# Altium schematic sheet MCU1.SchDoc: MCU 1 - RP2350B
size 420 x 297 mm; SheetNumber: 3; SheetTotal: 8
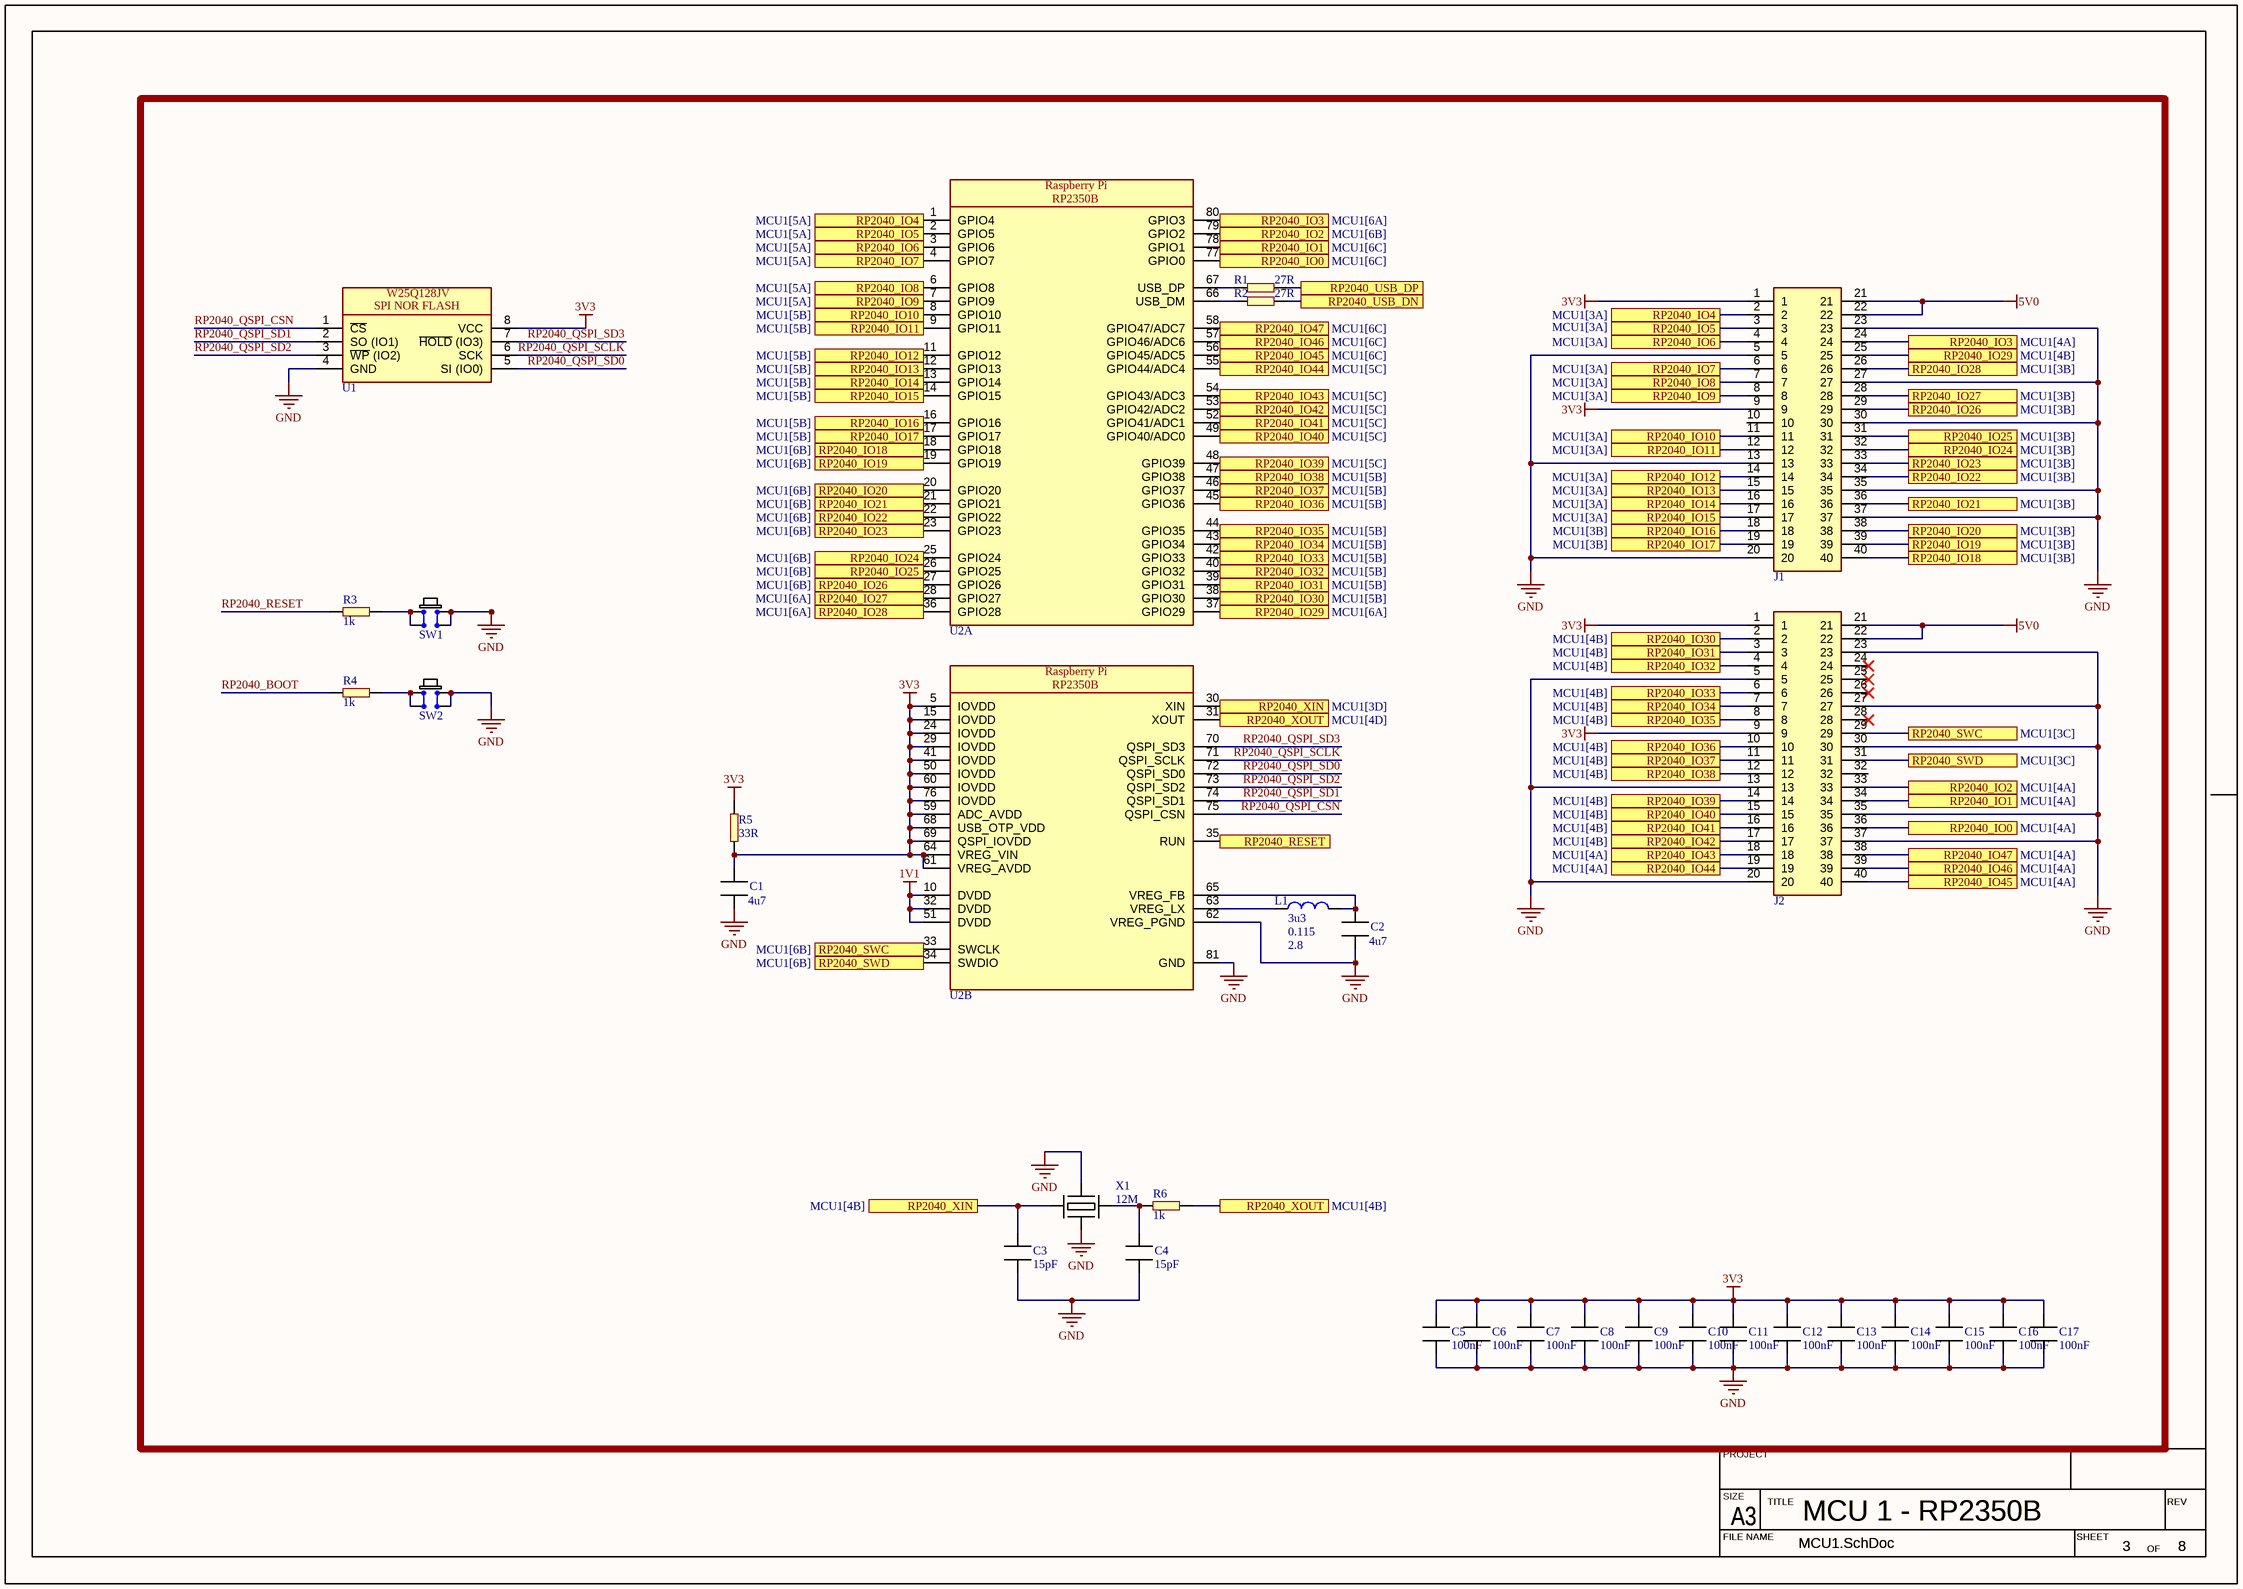
[diagram p0: MCU1.SchDoc]

## Parts
C1  value 4u7  [CAPC1608X10N]  (hidden comment: ERP_102-1)
C2  value 4u7  [CAPC1608X10N]  (hidden comment: ERP_102-1)
C3  value 15pF  [CAPC2012X13L]  (hidden comment: MLCC_0805)
C4  value 15pF  [CAPC2012X13L]  (hidden comment: MLCC_0805)
C5  value 100nF  [CAPC2012X13L]  (hidden comment: MLCC_0805)
C6  value 100nF  [CAPC2012X13L]  (hidden comment: MLCC_0805)
C7  value 100nF  [CAPC2012X13L]  (hidden comment: MLCC_0805)
C8  value 100nF  [CAPC2012X13L]  (hidden comment: MLCC_0805)
C9  value 100nF  [CAPC2012X13L]  (hidden comment: MLCC_0805)
C10  value 100nF  [CAPC2012X13L]  (hidden comment: MLCC_0805)
C11  value 100nF  [CAPC2012X13L]  (hidden comment: MLCC_0805)
C12  value 100nF  [CAPC2012X13L]  (hidden comment: MLCC_0805)
C13  value 100nF  [CAPC2012X13L]  (hidden comment: MLCC_0805)
C14  value 100nF  [CAPC2012X13L]  (hidden comment: MLCC_0805)
C15  value 100nF  [CAPC2012X13L]  (hidden comment: MLCC_0805)
C16  value 100nF  [CAPC2012X13L]  (hidden comment: MLCC_0805)
C17  value 100nF  [CAPC2012X13L]  (hidden comment: MLCC_0805)
J1  40PX2R_M_1  [40PX2R_Male_THT]  (value not drawn)
J2  40PX2R_M_1  [40PX2R_Male_THT]  (value not drawn)
L1  value 3u3  DCR: 0.115  ISAT: 2.8  [INDC2016X10M]  (hidden comment: AOTA-B201610S)
R1  value 27R  [RES_0805]  (hidden comment: ERP_101-1)
R2  value 27R  [RES_0805]  (hidden comment: ERP_101-1)
R3  value 1k  [RES_0805]  (hidden comment: ERP_101-1)
R4  value 1k  [RES_0805]  (hidden comment: ERP_101-1)
R5  value 33R  [RES_0603]  (hidden comment: ERP_101-1)
R6  value 1k  [RES_0805]  (hidden comment: ERP_101-1)
SW1  Generic6X6  [Generic6X6]  (value not drawn)
SW2  Generic6X6  [Generic6X6]  (value not drawn)
U1  W25Q128JV  [SOIC127P780X195-8N]  (value not drawn)
U2  RP2350B  [QFN40P1000X1000X90_HS-81M]  (value not drawn)  (parts A,B of 2)
X1  value 12M  [ABM8]  (hidden comment: ABM8)

## Ports
RP2040_IO0 (see MCU1[4A]), RP2040_IO0 (see MCU1[6C]), RP2040_IO1 (see MCU1[4A]), RP2040_IO1 (see MCU1[6C]), RP2040_IO2 (see MCU1[4A]), RP2040_IO2 (see MCU1[6B]), RP2040_IO3 (see MCU1[4A]), RP2040_IO3 (see MCU1[6A]), RP2040_IO4 (see MCU1[3A]), RP2040_IO4 (see MCU1[5A]), RP2040_IO5 (see MCU1[3A]), RP2040_IO5 (see MCU1[5A]), RP2040_IO6 (see MCU1[3A]), RP2040_IO6 (see MCU1[5A]), RP2040_IO7 (see MCU1[3A]), RP2040_IO7 (see MCU1[5A]), RP2040_IO8 (see MCU1[3A]), RP2040_IO8 (see MCU1[5A]), RP2040_IO9 (see MCU1[3A]), RP2040_IO9 (see MCU1[5A]), RP2040_IO10 (see MCU1[3A]), RP2040_IO10 (see MCU1[5B]), RP2040_IO11 (see MCU1[3A]), RP2040_IO11 (see MCU1[5B]), RP2040_IO12 (see MCU1[3A]), RP2040_IO12 (see MCU1[5B]), RP2040_IO13 (see MCU1[3A]), RP2040_IO13 (see MCU1[5B]), RP2040_IO14 (see MCU1[3A]), RP2040_IO14 (see MCU1[5B]), RP2040_IO15 (see MCU1[3A]), RP2040_IO15 (see MCU1[5B]), RP2040_IO16 (see MCU1[3B]), RP2040_IO16 (see MCU1[5B]), RP2040_IO17 (see MCU1[3B]), RP2040_IO17 (see MCU1[5B]), RP2040_IO18 (see MCU1[3B]), RP2040_IO18 (see MCU1[6B]), RP2040_IO19 (see MCU1[3B]), RP2040_IO19 (see MCU1[6B]), RP2040_IO20 (see MCU1[3B]), RP2040_IO20 (see MCU1[6B]), RP2040_IO21 (see MCU1[3B]), RP2040_IO21 (see MCU1[6B]), RP2040_IO22 (see MCU1[3B]), RP2040_IO22 (see MCU1[6B]), RP2040_IO23 (see MCU1[3B]), RP2040_IO23 (see MCU1[6B]), RP2040_IO24 (see MCU1[3B]), RP2040_IO24 (see MCU1[6B]), RP2040_IO25 (see MCU1[3B]), RP2040_IO25 (see MCU1[6B]), RP2040_IO26 (see MCU1[3B]), RP2040_IO26 (see MCU1[6B]), RP2040_IO27 (see MCU1[3B]), RP2040_IO27 (see MCU1[6A]), RP2040_IO28 (see MCU1[3B]), RP2040_IO28 (see MCU1[6A]), RP2040_IO29 (see MCU1[4B]), RP2040_IO29 (see MCU1[6A]), RP2040_IO30 (see MCU1[4B]), RP2040_IO30 (see MCU1[5B]), RP2040_IO31 (see MCU1[4B]), RP2040_IO31 (see MCU1[5B]), RP2040_IO32 (see MCU1[4B]), RP2040_IO32 (see MCU1[5B]), RP2040_IO33 (see MCU1[4B]), RP2040_IO33 (see MCU1[5B]), RP2040_IO34 (see MCU1[4B]), RP2040_IO34 (see MCU1[5B]), RP2040_IO35 (see MCU1[4B]), RP2040_IO35 (see MCU1[5B]), RP2040_IO36 (see MCU1[4B]), RP2040_IO36 (see MCU1[5B]), RP2040_IO37 (see MCU1[4B]), RP2040_IO37 (see MCU1[5B]), RP2040_IO38 (see MCU1[4B]), RP2040_IO38 (see MCU1[5B]), RP2040_IO39 (see MCU1[4B]), RP2040_IO39 (see MCU1[5C]), RP2040_IO40 (see MCU1[4B]), RP2040_IO40 (see MCU1[5C]), RP2040_IO41 (see MCU1[4B]), RP2040_IO41 (see MCU1[5C]), RP2040_IO42 (see MCU1[4B]), RP2040_IO42 (see MCU1[5C]), RP2040_IO43 (see MCU1[4A]), RP2040_IO43 (see MCU1[5C]), RP2040_IO44 (see MCU1[4A]), RP2040_IO44 (see MCU1[5C]), RP2040_IO45 (see MCU1[4A]), RP2040_IO45 (see MCU1[6C]), RP2040_IO46 (see MCU1[4A]), RP2040_IO46 (see MCU1[6C]), RP2040_IO47 (see MCU1[4A]), RP2040_IO47 (see MCU1[6C]), RP2040_RESET, RP2040_SWC (see MCU1[3C]), RP2040_SWC (see MCU1[6B]), RP2040_SWD (see MCU1[3C]), RP2040_SWD (see MCU1[6B]), RP2040_USB_DN, RP2040_USB_DP, RP2040_XIN (see MCU1[3D]), RP2040_XIN (see MCU1[4B]), RP2040_XOUT (see MCU1[4B]), RP2040_XOUT (see MCU1[4D])

## Nets
1V1: U2.10(DVDD) U2.32(DVDD) U2.51(DVDD)
3V3: C1.1 C5.1 C6.1 C7.1 C8.1 C9.1 C10.1 C11.1 C12.1 C13.1 C14.1 C15.1 C16.1 C17.1 J1.1 J1.9 J2.1 J2.9 R5.1 R5.2 U1.8(VCC) U2.5(IOVDD) U2.15(IOVDD) U2.24(IOVDD) U2.29(IOVDD) U2.41(IOVDD) U2.50(IOVDD) U2.59(ADC_AVDD) U2.60(IOVDD) U2.61(VREG_AVDD) U2.64(VREG_VIN) U2.68(USB_OTP_VDD) U2.69(QSPI_IOVDD) U2.76(IOVDD)
5V0: J1.21 J1.22 J2.21 J2.22
GND: C1.2 C2.2 C3.2 C4.2 C5.2 C6.2 C7.2 C8.2 C9.2 C10.2 C11.2 C12.2 C13.2 C14.2 C15.2 C16.2 C17.2 J1.5 J1.13 J1.20 J1.23 J1.27 J1.30 J1.35 J1.37 J2.5 J2.13 J2.20 J2.23 J2.27 J2.30 J2.35 J2.37 SW1.3(COM) SW1.4(COM) SW2.3(COM) SW2.4(COM) U1.4(GND) U2.62(VREG_PGND) U2.81(GND) X1.2 X1.4
RP2040_BOOT: R4.2
RP2040_IO0: J2.36 U2.77(GPIO0) ; port RP2040_IO0
RP2040_IO1: J2.34 U2.78(GPIO1) ; port RP2040_IO1
RP2040_IO2: J2.33 U2.79(GPIO2) ; port RP2040_IO2
RP2040_IO3: J1.24 U2.80(GPIO3) ; port RP2040_IO3
RP2040_IO4: J1.2 U2.1(GPIO4) ; port RP2040_IO4
RP2040_IO5: J1.3 U2.2(GPIO5) ; port RP2040_IO5
RP2040_IO6: J1.4 U2.3(GPIO6) ; port RP2040_IO6
RP2040_IO7: J1.6 U2.4(GPIO7) ; port RP2040_IO7
RP2040_IO8: J1.7 U2.6(GPIO8) ; port RP2040_IO8
RP2040_IO9: J1.8 U2.7(GPIO9) ; port RP2040_IO9
RP2040_IO10: J1.11 U2.8(GPIO10) ; port RP2040_IO10
RP2040_IO11: J1.12 U2.9(GPIO11) ; port RP2040_IO11
RP2040_IO12: J1.14 U2.11(GPIO12) ; port RP2040_IO12
RP2040_IO13: J1.15 U2.12(GPIO13) ; port RP2040_IO13
RP2040_IO14: J1.16 U2.13(GPIO14) ; port RP2040_IO14
RP2040_IO15: J1.17 U2.14(GPIO15) ; port RP2040_IO15
RP2040_IO16: J1.18 U2.16(GPIO16) ; port RP2040_IO16
RP2040_IO17: J1.19 U2.17(GPIO17) ; port RP2040_IO17
RP2040_IO18: J1.40 U2.18(GPIO18) ; port RP2040_IO18
RP2040_IO19: J1.39 U2.19(GPIO19) ; port RP2040_IO19
RP2040_IO20: J1.38 U2.20(GPIO20) ; port RP2040_IO20
RP2040_IO21: J1.36 U2.21(GPIO21) ; port RP2040_IO21
RP2040_IO22: J1.34 U2.22(GPIO22) ; port RP2040_IO22
RP2040_IO23: J1.33 U2.23(GPIO23) ; port RP2040_IO23
RP2040_IO24: J1.32 U2.25(GPIO24) ; port RP2040_IO24
RP2040_IO25: J1.31 U2.26(GPIO25) ; port RP2040_IO25
RP2040_IO26: J1.29 U2.27(GPIO26) ; port RP2040_IO26
RP2040_IO27: J1.28 U2.28(GPIO27) ; port RP2040_IO27
RP2040_IO28: J1.26 U2.36(GPIO28) ; port RP2040_IO28
RP2040_IO29: J1.25 U2.37(GPIO29) ; port RP2040_IO29
RP2040_IO30: J2.2 U2.38(GPIO30) ; port RP2040_IO30
RP2040_IO31: J2.3 U2.39(GPIO31) ; port RP2040_IO31
RP2040_IO32: J2.4 U2.40(GPIO32) ; port RP2040_IO32
RP2040_IO33: J2.6 U2.42(GPIO33) ; port RP2040_IO33
RP2040_IO34: J2.7 U2.43(GPIO34) ; port RP2040_IO34
RP2040_IO35: J2.8 U2.44(GPIO35) ; port RP2040_IO35
RP2040_IO36: J2.10 U2.45(GPIO36) ; port RP2040_IO36
RP2040_IO37: J2.11 U2.46(GPIO37) ; port RP2040_IO37
RP2040_IO38: J2.12 U2.47(GPIO38) ; port RP2040_IO38
RP2040_IO39: J2.14 U2.48(GPIO39) ; port RP2040_IO39
RP2040_IO40: J2.15 U2.49(GPIO40/ADC0) ; port RP2040_IO40
RP2040_IO41: J2.16 U2.52(GPIO41/ADC1) ; port RP2040_IO41
RP2040_IO42: J2.17 U2.53(GPIO42/ADC2) ; port RP2040_IO42
RP2040_IO43: J2.18 U2.54(GPIO43/ADC3) ; port RP2040_IO43
RP2040_IO44: J2.19 U2.55(GPIO44/ADC4) ; port RP2040_IO44
RP2040_IO45: J2.40 U2.56(GPIO45/ADC5) ; port RP2040_IO45
RP2040_IO46: J2.39 U2.57(GPIO46/ADC6) ; port RP2040_IO46
RP2040_IO47: J2.38 U2.58(GPIO47/ADC7) ; port RP2040_IO47
RP2040_QSPI_CSN: U1.1(~{CS}) U2.75(QSPI_CSN)
RP2040_QSPI_SCLK: U1.6(SCK) U2.71(QSPI_SCLK)
RP2040_QSPI_SD0: U1.5(SI_(IO0)) U2.72(QSPI_SD0)
RP2040_QSPI_SD1: U1.2(SO_(IO1)) U2.74(QSPI_SD1)
RP2040_QSPI_SD2: U1.3(~{WP}_(IO2)) U2.73(QSPI_SD2)
RP2040_QSPI_SD3: U1.7(~{HOLD}_(IO3)) U2.70(QSPI_SD3)
RP2040_RESET: R3.2
RP2040_RESET: U2.35(RUN) ; port RP2040_RESET  [a separate net that carries the same name]
RP2040_SWC: J2.29 U2.33(SWCLK) ; port RP2040_SWC
RP2040_SWD: J2.31 U2.34(SWDIO) ; port RP2040_SWD
RP2040_USB_DN: R2.1 ; port RP2040_USB_DN
RP2040_USB_DP: R1.1 ; port RP2040_USB_DP
RP2040_XIN: C3.1 U2.30(XIN) X1.1 ; port RP2040_XIN
RP2040_XOUT: R6.1 U2.31(XOUT) ; port RP2040_XOUT
NetC2_1: C2.1 L1.2 U2.65(VREG_FB)
NetC4_1: C4.1 R6.2 X1.3
NetL1_1: L1.1 U2.63(VREG_LX)
NetR1_2: R1.2 U2.67(USB_DP)
NetR2_2: R2.2 U2.66(USB_DM)
NetR3_1: R3.1 SW1.1(NO) SW1.2(NO)
NetR4_1: R4.1 SW2.1(NO) SW2.2(NO)

Not connected (* = marked no-connect by the designer): J1 10; J2 24* 25* 26* 28* 32

## Notes on the sheet
- PROJECT
- SIZE
- FILE NAME
- A3
- TITLE
- SHEET
- OF
- REV
- (in symbol W25Q128JV) SPI NOR FLASH

## Library data of the parts
C1 C2 = MLCC_0603: Chip Capacitor, 2-Leads, Body 1.60x0.80mm, IPC Medium Density; Package: 0603; Manufacturer 1: *; Manufacturer Part Number 1: *
C3-C17 = MLCC_0805: Chip Capacitor, 2-Leads, Body 2.00x1.25mm, IPC High Density; Package: 0805; Manufacturer 1: *; Manufacturer Part Number 1: *
J1 J2 = 40PX2R_M_1: Berg Connector Header Through Hole  40 Position 0.100" (2.54mm); Manufacturer 1: CNC Tech; Value: *; Manufacturer Part Number 1: *
L1 = AOTA-B201610S: AOTA-B201610S Abracon 2.0 x 1.6 MM; Manufacturer Part Number 1: AOTA-B201610S3R3-101-T; Manufacturer 1: Abracon
R1-R4 R6 = RES_0805: Package: 0805; Manufacturer 1: *; Manufacturer Part Number 1: *
R5 = RES_0603: Package: 0603; Manufacturer 1: *; Manufacturer Part Number 1: *
SW1 SW2 = Generic6X6: Tactile Switch SPST-NO Top Actuated Surface Mount; Manufacturer 1: C&K; Manufacturer Part Number 1: *; Package: 4.5X4.5
U1 = W25Q128JV: FLASH - NOR Memory IC SPI - Quad I/O 133 MHz 8-SOIC; Manufacturer 1: Winbond; Manufacturer Part Number 1: W25Q128JVSIQ; Value: 16M; Package: 8-SOIC
U2 = RP2350B: Dual ARM Cortex M33 - Microcontroller IC 32-Bit 80-QFN (10x10); Manufacturer Part Number 1: RP2040; Manufacturer 1: Raspberry Pi; Package: QFN56; Value: *; Supplier Part Number 1: *; Supplier 1: *
X1 = ABM8: CRYS_L3.2_W2.5; Manufacturer Part Number 1: ABM8-272-T3; Manufacturer 1: Abracon LLC